# Altium schematic sheet DCDC_Traco.SchDoc: DC-DC converter stage
size A3; Organization: ORGANIZATION; Address1: ADDRESS 1; Address2: ADDRESS 2; Address3: ADDRESS 3; Address4: ADDRESS 4; Revision: 0.0; SheetNumber: 13; SheetTotal: 19; ENG_APP_DATE: --/--/--; DSN_APP_DATE: --/--/--; CHK_APP_DATE: --/--/--
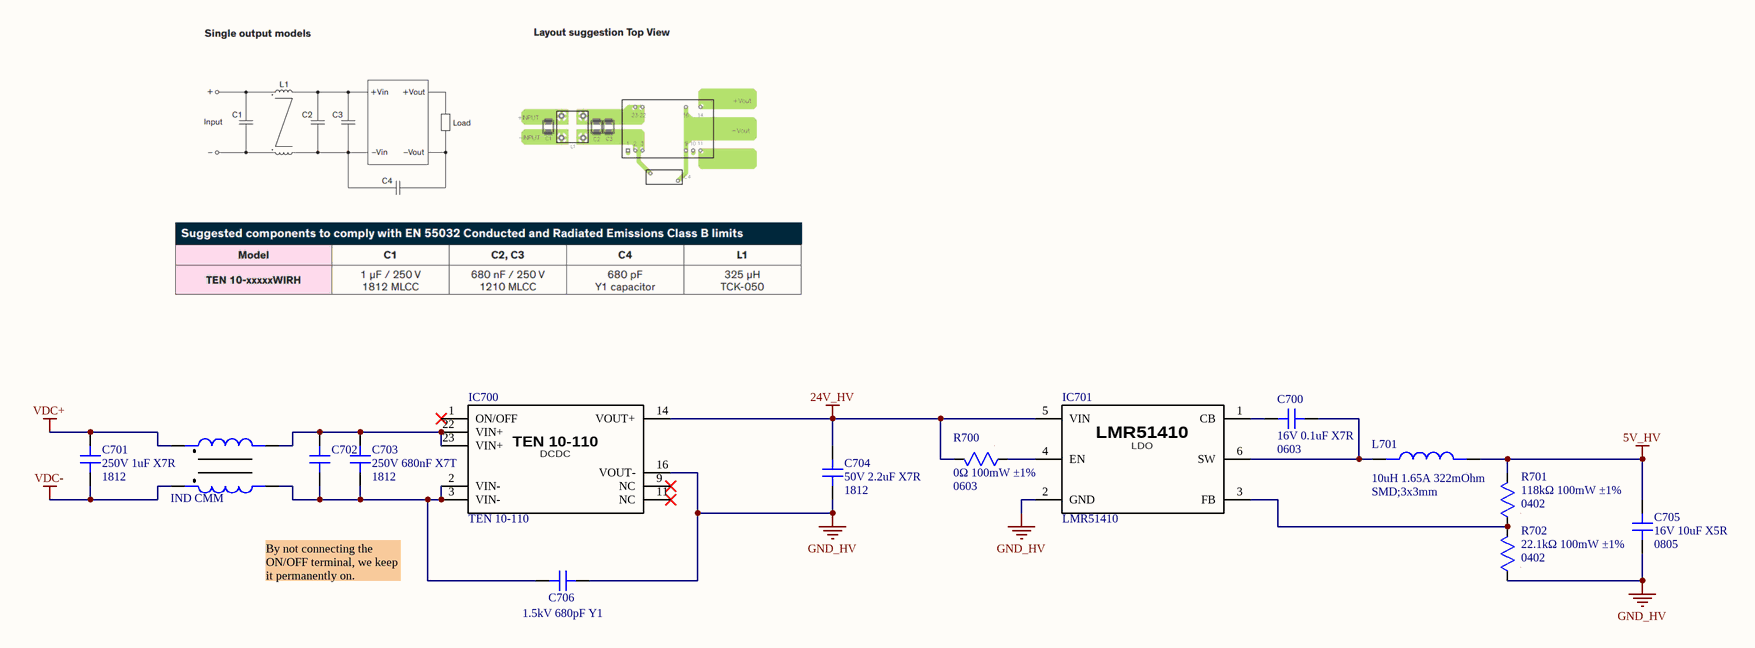
[diagram p0: DCDC_Traco.SchDoc]

## Parts
C700  value 16V 0.1uF X7R  Package: 0603  [CAP SMD 0603]  (hidden comment: CAP non polarized)
C701  value 250V 1uF X7R  Package: 1812  [CAP SMD 1812]  (hidden comment: CAP non polarized)
C702  CAP non polarized  [CAP SMD 1812]  (value not drawn)
C703  value 250V 680nF X7T  Package: 1812  [CAP SMD 1812]  (hidden comment: CAP non polarized)
C704  value 50V 2.2uF X7R  Package: 1812  [CAP SMD 1812]  (hidden comment: CAP non polarized)
C705  value 16V 10uF X5R  Package: 0805  [CAP SMD 0805]  (hidden comment: CAP non polarized)
C706  value 1.5kV 680pF Y1  [CAP_15Px12.5H]  (hidden comment: CAP non polarized)
IC700  TEN 10-110  [TEN 10-110]
IC701  LMR51410  [SOT-23-6]
L700  IND CMM  [IND_CMM_THT_11x11mm]
L701  value 10uH 1.65A 322mOhm  Package: SMD;3x3mm  [IND SMD 3x3]  (hidden comment: IND)
R700  value 0Ω 100mW ±1%  Package: 0603  [RES SMD 0603]  (hidden comment: RES)
R701  value 118kΩ 100mW ±1%  Package: 0402  [RES SMD 0402]  (hidden comment: RES)
R702  value 22.1kΩ 100mW ±1%  Package: 0402  [RES SMD 0402]  (hidden comment: RES)

## Nets
5V_HV: C705.1 L701.2 R701.2
24V_HV: C704.1 IC700.14(VOUT+) IC701.5(VIN) R700.2
GND_HV: C704.2 C705.2 C706.2 IC700.16(VOUT-) IC701.2(GND) R702.1
VDC+: C701.1 L700.1
VDC-: C701.2 L700.4
NetC700_1: C700.1 IC701.1(CB)
NetC700_2: C700.2 IC701.6(SW) L701.1
NetC702_1: C702.1 C703.1 IC700.22(VIN+) IC700.23(VIN+) L700.2
NetC702_2: C702.2 C703.2 C706.1 IC700.2(VIN-) IC700.3(VIN-) L700.3
NetIC701_3: IC701.3(FB) R701.1 R702.2
NetIC701_4: IC701.4(EN) R700.1

Not connected (* = marked no-connect by the designer): IC700 1(ON/OFF)* 9(NC)* 11(NC)*

## Notes on the sheet
- By not connecting the ON/OFF terminal, we keep it permanently on.
- Project:
- Subsystem:
- Company:
- Document:
- Author:
- Revision:
- Date:
- Sheet:
- /
- (in symbol 070-0004) DCDC
- (in symbol 070-0007) LDO

## Library data of the parts
C700 = 001-0112: Condensadores de cerámica multicapa (MLCC- SMD/SMT) WCAP-CSGP 0.1uF 0603 10% 16V MLCC; MPN: 885012206046; Manufacturer: Wurth Elektronik; ComponentLink1Description: Datasheet; ComponentLink1URL: https://www.we-online.com/components/products/datasheet/885012206046.pdf; ComponentLink2Description: Distributor Link; ComponentLink2URL: https://www.mouser.es/ProductDetail/Wurth-Elektronik/885012206046?qs=0KOYDY2FL2%252B89gr6HvTBXA%3D%3D; ID: 001-0112; Distributor PN: 710-885012206046; Distributor: Mouser
C701 = 001-0117: Condensadores de cerámica multicapa (MLCC- SMD/SMT) 250V 1uF X7R 1812 10 %; MPN: 1812VC105KAT2A; Manufacturer: KYOCERA AVX; ComponentLink1Description: Datasheet; ComponentLink1URL: https://datasheets.kyocera-avx.com/AVX-HV_MLCC.pdf; ComponentLink2Description: Distributor Link; ComponentLink2URL: https://www.mouser.es/ProductDetail/KYOCERA-AVX/1812VC105KAT2A?qs=sGAEpiMZZMvsSlwiRhF8qtsBU8Zhqm2RiX3yQof58UA8TRVHqLE0IA%3D%3D; ID: 001-0117; Distributor PN: 581-1812VC105KAT2A; Distributor: Mouser
C702 = 001-0118: Condensadores de cerámica multicapa (MLCC- SMD/SMT) 1812 250V 0.68uF X7T 20% T: 1.6mm; MPN: C4532X7T2E684M160KA; Manufacturer: TDK; Value: 250V 680nF X7T; ComponentLink1Description: Datasheet; ComponentLink1URL: https://product.tdk.com/system/files/dam/doc/product/capacitor/ceramic/mlcc/catalog/mlcc_commercial_highvoltage_en.pdf; ComponentLink2Description: Distributor Link; ComponentLink2URL: https://www.mouser.es/ProductDetail/TDK/C4532X7T2E684M160KA?qs=sGAEpiMZZMvsSlwiRhF8qtKev7nvVKumgcECMxBqJildLuXsoVBqzA%3D%3D; Package: 1812; ID: 001-0118; Distributor PN: 810-C4532X7T2E684M6K; Distributor: Mouser
C703 = 001-0118: Condensadores de cerámica multicapa (MLCC- SMD/SMT) 1812 250V 0.68uF X7T 20% T: 1.6mm; MPN: C4532X7T2E684M160KA; Manufacturer: TDK; ComponentLink1Description: Datasheet; ComponentLink1URL: https://product.tdk.com/system/files/dam/doc/product/capacitor/ceramic/mlcc/catalog/mlcc_commercial_highvoltage_en.pdf; ComponentLink2Description: Distributor Link; ComponentLink2URL: https://www.mouser.es/ProductDetail/TDK/C4532X7T2E684M160KA?qs=sGAEpiMZZMvsSlwiRhF8qtKev7nvVKumgcECMxBqJildLuXsoVBqzA%3D%3D; ID: 001-0118; Distributor PN: 810-C4532X7T2E684M6K; Distributor: Mouser
C704 = 001-0122: Condensadores de cerámica multicapa (MLCC- SMD/SMT) WCAP-CSGP 2.2uF 1812 10% 50V MLCC; MPN: 885012210032; Manufacturer: Wurth Elektronik; ComponentLink1Description: Datasheet; ComponentLink1URL: https://www.we-online.com/components/products/datasheet/885012210032.pdf; ComponentLink2Description: Distributor Link; ComponentLink2URL: https://www.mouser.es/ProductDetail/Wurth-Elektronik/885012210032?qs=0KOYDY2FL28JFhdrfHzb7w%3D%3D; ID: 001-0122; Distributor PN: 710-885012210032; Distributor: Mouser
C705 = 001-0111: Condensadores de cerámica multicapa (MLCC- SMD/SMT) WCAP-CSGP 10uF 0805 20% 16V MLCC; MPN: 885012107014; Manufacturer: Wurth Elektronik; ComponentLink1Description: Datasheet; ComponentLink1URL: https://www.we-online.com/components/products/datasheet/885012107014.pdf; ComponentLink2Description: Distributor Link; ComponentLink2URL: https://www.mouser.es/ProductDetail/Wurth-Elektronik/885012107014?qs=0KOYDY2FL28i0pwNdARIlg%3D%3D; ID: 001-0111; Distributor PN: 710-885012107014; Distributor: Mouser
C706 = 004-0002: Condensadores de seguridad 500volts 680pF 20% LS=15mm; MPN: P295BE681M500A; Manufacturer: KEMET; ComponentLink1Description: Datasheet; ComponentLink1URL: https://www.mouser.es/datasheet/3/72/1/KEM_F3088_P295_Y1_500.pdf; ComponentLink2Description: Distributor Link; ComponentLink2URL: https://www.mouser.es/ProductDetail/KEMET/P295BE681M500A?qs=zoGAYOF739DgwL35ue4hHg%3D%3D; ID: 004-0002; Package: THT;W5.5xL18mm; Distributor PN: 80-P295BE681M500A; Distributor: Mouser
IC700 = 070-0004: Convertidores DC/DC para montaje pasante 10W DC/DC Converter isolated, regulated in a PCB Mount Plastic Case; MPN: TEN 10-11015WIRH; Manufacturer: TRACO Power; Value: 110V-24V; ComponentLink1Description: Datasheet; ComponentLink1URL: https://www.tracopower.com/ten10wirh-datasheet; ComponentLink2Description: Distributor Link; ComponentLink2URL: https://www.mouser.es/ProductDetail/TRACO-Power/TEN-10-11015WIRH?qs=A6eO%252BMLsxmQM8M6%2FnJVPNg%3D%3D; ID: 070-0004; Package: 31.8x20.3x10.6mm; Distributor PN: 495-TEN10-11015WIRH; Distributor: Mouser
IC701 = 070-0007: Reguladores de tensión de conmutación SIMPLE SWITCHER 4V t o 42V 1A synchronou; MPN: LMR51410YFDBVR; Manufacturer: Texas Instruments; Value: (4/42)V-(0.8/28)V; ComponentLink1Description: Datasheet; ComponentLink1URL: https://www.ti.com/lit/ds/symlink/lmr51410.pdf?ts=1781684561920&ref_url=https%253A%252F%252Fwww.mouser.de%252F; ComponentLink2Description: Distributor Link; ComponentLink2URL: https://www.mouser.es/ProductDetail/Texas-Instruments/LMR51410YFDBVR?qs=i8QVZAFTkqTUiBodeYrDsw%3D%3D; ID: 070-0007; Package: SOT-23-6; Distributor PN: 595-LMR51410YFDBVR; Distributor: Mouser
L700 = 023-0002: Cebadores / filtros de modo común Filter Component; MPN: TCK-050; Manufacturer: TRACO Power; Value: 325uH 3.3A 35 %; ComponentLink1Description: Datasheet; ComponentLink1URL: https://www.mouser.es/datasheet/3/1230/1/tck_050_datasheet.pdf; ComponentLink2Description: Distributor Link; ComponentLink2URL: https://www.mouser.es/ProductDetail/TRACO-Power/TCK-050?qs=ckJk83FOD0VjpXDswRrv6g%3D%3D; ID: 023-0002; Package: 11x11x8.8; Distributor PN: 495-TCK-050; Distributor: Mouser
L701 = 020-0001: Inductores de potencia (SMD) WE-MAPI 10uH 1.2A DCR=322mOhms AEC-Q200; MPN: 74438336100; Manufacturer: Wurth Elektronik; ComponentLink1Description: Datasheet; ComponentLink1URL: https://www.we-online.com/components/products/datasheet/74438336100.pdf; ComponentLink2Description: Distributor Link; ComponentLink2URL: https://www.mouser.es/ProductDetail/Wurth-Elektronik/74438336100?qs=iC14BvcgY%2F3tj5fn6qP7Hg%3D%3D; ID: 020-0001; Distributor PN: 710-74438336100; Distributor: Mouser
R700 = 010-0160: Resistores de película gruesa - SMD WRIS-RSKS <0.05 Ohms 0.1 W Jumper 0603 AEC-Q200; MPN: 5,60112116e+11; Manufacturer: Wurth Elektronik; ComponentLink1Description: Datasheet; ComponentLink1URL: https://www.we-online.com/components/products/datasheet/560112116001.pdf; ComponentLink2Description: Distributor Link; ComponentLink2URL: https://www.mouser.es/ProductDetail/Wurth-Elektronik/560112116001?qs=mELouGlnn3dlnHYj7TecuA%3D%3D; ID: 010-0160; Distributor PN: 710-560112116001; Distributor: Mouser
R701 = 010-0156: Resistores de película gruesa - SMD WRIS-RSKS 118 kOhms 1 % 0.1 W 0402 AEC-Q200; MPN: 560112110142; Manufacturer: Wurth Elektronik; ComponentLink1Description: Datasheet; ComponentLink1URL: https://www.we-online.com/components/products/datasheet/560112110142.pdf; ComponentLink2Description: Distributor Link; ComponentLink2URL: https://www.mouser.es/ProductDetail/Wurth-Elektronik/560112110142?qs=mELouGlnn3daEwPMtfpdeg%3D%3D; ID: 010-0156; Distributor PN: 710-560112110142; Distributor: Mouser
R702 = 010-0157: Resistores de película gruesa - SMD WRIS-RSKS 22.1 kOhms 1 % 0.1 W 0402 AEC-Q200; MPN: 560112110099; Manufacturer: Wurth Elektronik; ComponentLink1Description: Datasheet; ComponentLink1URL: https://www.we-online.com/components/products/datasheet/560112110099.pdf; ComponentLink2Description: Distributor Link; ComponentLink2URL: https://www.mouser.es/ProductDetail/Wurth-Elektronik/560112110099?qs=mELouGlnn3eF8MLEVMJrCw%3D%3D; ID: 010-0157; Distributor PN: 710-560112110099; Distributor: Mouser